# Altium schematic sheet [8]-OUTPUTS.SchDoc
size A4
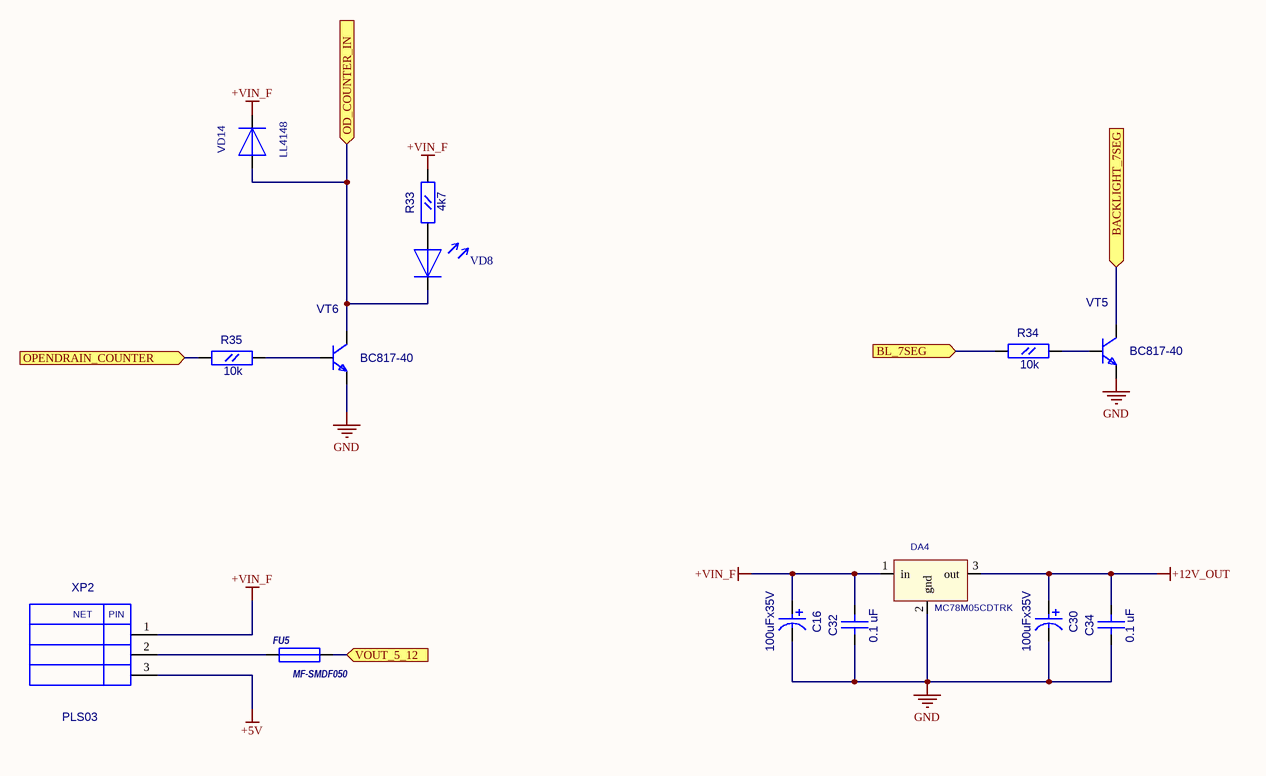
[diagram p0: [8]-OUTPUTS.SchDoc]

## Parts
C16  100uFx35V  [CC8X3.5]
C30  100uFx35V  [CC8X3.5]
C32  0.1 uF  [CC0603]
C34  0.1 uF  [CC0603]
DA4  MC78M05CDTRK  [D-PAK(TO-252AA)]
FU5  MF-SMDF050  [MF-SMDF]
R33  4k7  [RC0603]
R34  10k  [RC0603]
R35  10k  [RC0603]
VD8  LED_0805  [LED0805]  (value not drawn)
VD14  LL4148  [SOD-80]
VT5  BC817-40  [SOT-23(123)]
VT6  BC817-40  [SOT-23(123)]
XP2  PLS03  [PLS-03]

## Ports
BACKLIGHT_7SEG (in), BL_7SEG (in), OD_COUNTER_IN (in), OPENDRAIN_COUNTER (in), VOUT_5_12 (in)

## Nets
+5V: XP2.3
+12V_OUT: C30.1 C34.1(A) DA4.3(out)
+VIN_F: C16.1 C32.1(A) DA4.1(in) R33.2(B) VD14.2(+) XP2.1
GND: C16.2 C30.2 C32.2(B) C34.2(B) DA4.2(gnd) VT5.2(E) VT6.2(E)
BACKLIGHT_7SEG: VT5.3(C) ; port BACKLIGHT_7SEG
BL_7SEG: R34.1(A) ; port BL_7SEG
OD_COUNTER_IN: VD8.2 VD14.1(-) VT6.3(C) ; port OD_COUNTER_IN
OPENDRAIN_COUNTER: R35.1(A) ; port OPENDRAIN_COUNTER
VOUT_5_12: FU5.2 ; port VOUT_5_12
NetFU5_1: FU5.1 XP2.2
NetR33_1: R33.1(A) VD8.1
NetR34_2: R34.2(B) VT5.1(B)
NetR35_2: R35.2(B) VT6.1(B)

## Notes on the sheet
- (in symbol PLS03) NET; PIN

## Library data of the parts
C16 C30 = CAP_8mm: Radial capacitor; Value: 100uFx35V
C32 C34 = CC0603: Value: 0.1 uF
DA4 = MC78M05CDTRK: MC78M12CDTRK; Value: *
FU5 = MF-SMDF: Value: MF-SMDF050
R33-R35 = RC0603
  R33: Value: 4k7
  R34 R35: Value: 10k
VT5 VT6 = BC846BLT1: NPN 500ma transistor; ComponentField7: Published 29-Sep-2000; OriginalName: BC846BLT1; Value: BC817-40
VD8 = LED_0805: Value: LED_0805
VD14 = LL4148: Value: *
XP2 = PLS03: Value: *